# Altium schematic sheet lvds4ch.SchDoc
size A4
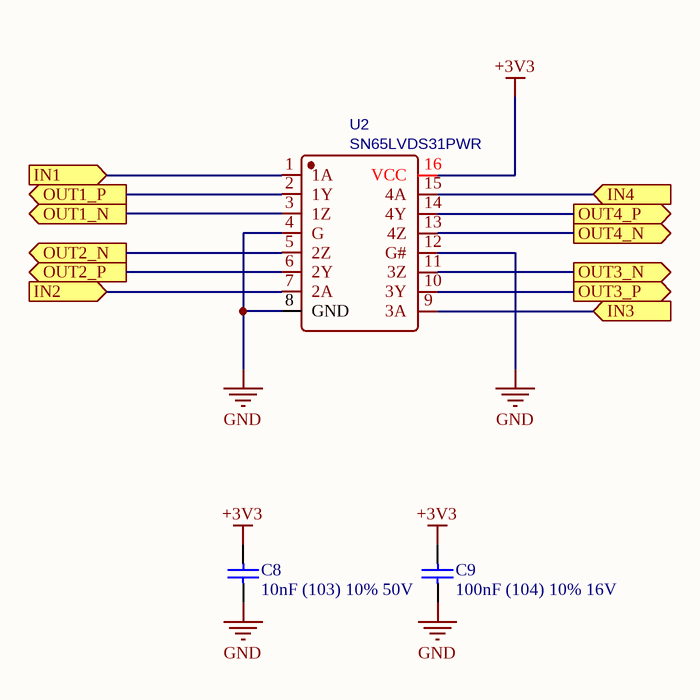
[diagram p0: lvds4ch.SchDoc]

## Parts
C8  10nF (103) 10% 50V  [0402_C]
C9  100nF (104) 10% 16V  [0402_C]
U2  SN65LVDS31PWR  [TSSOP-16_L5.0-W4.4-P0.65-LS6.4-BL]

## Ports
IN1 (in), IN2 (in), IN3 (in), IN4 (in), OUT1_N (out), OUT1_P (out), OUT2_N (out), OUT2_P (out), OUT3_N (out), OUT3_P (out), OUT4_N (out), OUT4_P (out)

## Nets
+3V3: C8.2 C9.2 U2.16(VCC)
GND: C8.1 C9.1 U2.4(G) U2.8(GND) U2.12(G#)
IN1: U2.1(1A) ; port IN1
IN2: U2.7(2A) ; port IN2
IN3: U2.9(3A) ; port IN3
IN4: U2.15(4A) ; port IN4
OUT1_N: U2.3(1Z) ; port OUT1_N
OUT1_P: U2.2(1Y) ; port OUT1_P
OUT2_N: U2.5(2Z) ; port OUT2_N
OUT2_P: U2.6(2Y) ; port OUT2_P
OUT3_N: U2.11(3Z) ; port OUT3_N
OUT3_P: U2.10(3Y) ; port OUT3_P
OUT4_N: U2.13(4Z) ; port OUT4_N
OUT4_P: U2.14(4Y) ; port OUT4_P

## Library data of the parts
C8 = 0402 10nF (103) 10% 50V: 贴片电容; ComponentLink1Description: 供应商链接; ComponentLink1URL: http://www.szlcsc.com/product/details_15869.html; Package: 0402; Supplier: LC; SuppliersPartNumber: C15195
C9 = 0402 100nF (104) 10% 16V: 贴片电容; ComponentLink1Description: 供应商链接; ComponentLink1URL: http://www.szlcsc.com/product/details_1877.html; Package: 0402; Supplier: LC; SuppliersPartNumber: C1525
U2 = SN65LVDS31PWR: BOM_Manufacturer: TI; Voltage - Supply: 3V ~ 3.6V; Contributor: LCSC; SMT Type: Extend; BOM_Supplier: LCSC; BOM_Manufacturer Part: SN65LVDS31PWR; Type: Driver; BOM_Supplier Part: C181630; BOM_LCSC Assembly: Yes; spicePre: U; spiceSymbolName: SN65LVDS31PWR